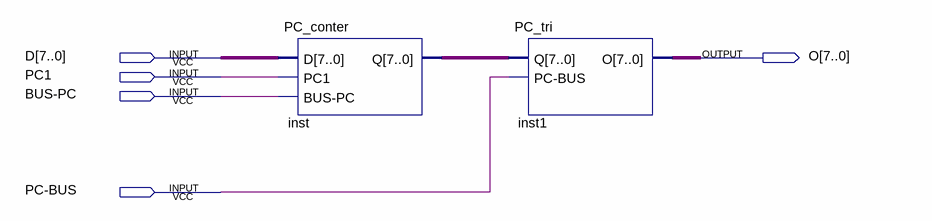
[diagram p0: schematic sheet]
// Quartus schematic PC.bdf as structural Verilog: 2 symbols, 5 pins
module PC (
  input  [7:0] D,
  input  PC1,
  input  \BUS-PC ,
  input  \PC-BUS ,
  output [7:0] O
);

  wire [7:0] inst_q;

  PC_conter inst (.D(D), .PC1(PC1), .\BUS-PC (\BUS-PC ), .Q(inst_q));
  PC_tri inst1 (.Q(inst_q), .\PC-BUS (\PC-BUS ), .O(O));
endmodule
